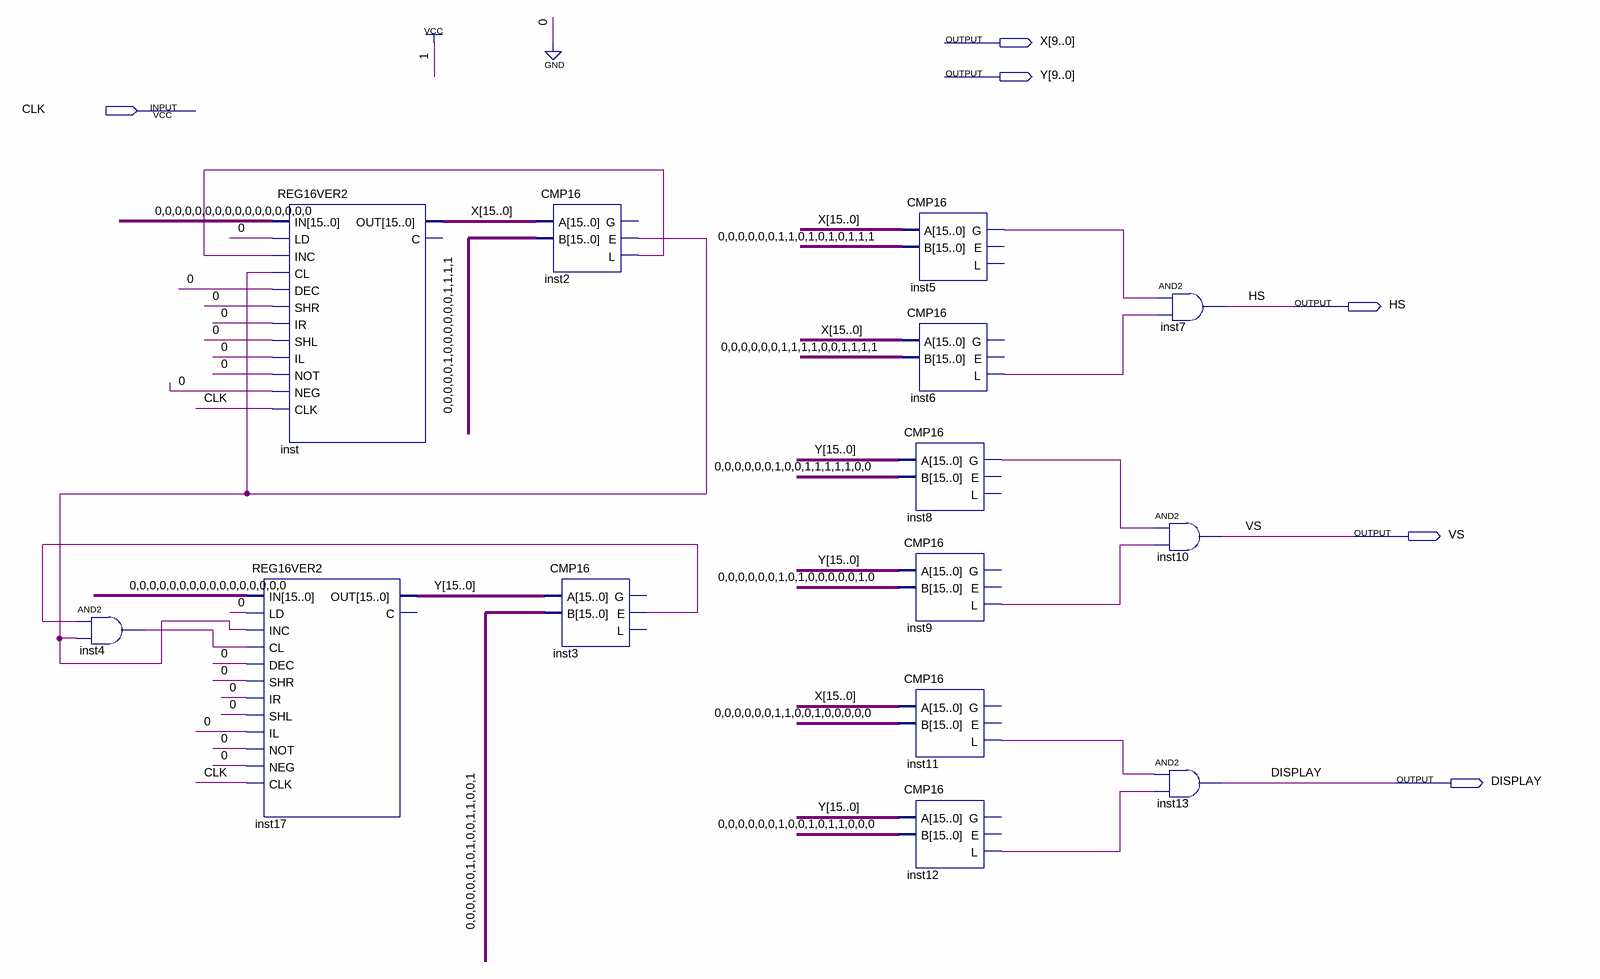
[diagram p0: schematic sheet]
// Quartus schematic ControllerNAS.bdf as structural Verilog: 14 symbols, 6 pins
module ControllerNAS (
  input  CLK,
  output [15:0] X,
  output [15:0] Y,
  output HS,
  output VS,
  output DISPLAY
);

  wire inst2_e, inst2_l, inst3_e, inst4_out, inst5_g, inst6_l, inst8_g, inst9_l, inst11_l, inst12_l;

  and inst4 (inst4_out, inst3_e, inst2_e);
  REG16VER2 inst (
    .IN({16{1'b0}}), .LD(1'b0), .INC(inst2_l), .CL(inst2_e), .DEC(1'b0), .SHR(1'b0), .IR(1'b0), .SHL(1'b0),
    .IL(1'b0), .NOT(1'b0), .NEG(1'b0), .CLK(CLK), .OUT(X));  // open: C
  REG16VER2 inst17 (
    .IN({16{1'b0}}), .LD(1'b0), .INC(inst2_e), .CL(inst4_out), .DEC(1'b0), .SHR(1'b0), .IR(1'b0), .SHL(1'b0),
    .IL(1'b0), .NOT(1'b0), .NEG(1'b0), .CLK(CLK), .OUT(Y));  // open: C
  CMP16 inst2 (.A(X), .B(16'b0000010000001111), .E(inst2_e), .L(inst2_l));  // open: G
  CMP16 inst3 (.A(Y), .B(16'b0000001010011001), .E(inst3_e));  // open: G, L
  CMP16 inst5 (.A(X), .B(16'b0000001101010111), .G(inst5_g));  // open: E, L
  CMP16 inst6 (.A(X), .B(16'b0000001111001111), .L(inst6_l));  // open: G, E
  CMP16 inst8 (.A(Y), .B(16'b0000001001111100), .G(inst8_g));  // open: E, L
  CMP16 inst9 (.A(Y), .B(16'b0000001010000010), .L(inst9_l));  // open: G, E
  CMP16 inst11 (.A(X), .B(16'b0000001100100000), .L(inst11_l));  // open: G, E
  CMP16 inst12 (.A(Y), .B(16'b0000001001011000), .L(inst12_l));  // open: G, E
  and inst7 (HS, inst5_g, inst6_l);
  and inst10 (VS, inst8_g, inst9_l);
  and inst13 (DISPLAY, inst11_l, inst12_l);
endmodule
